# EAGLE design nyuulyzerv1 (EAGLE 5.11)
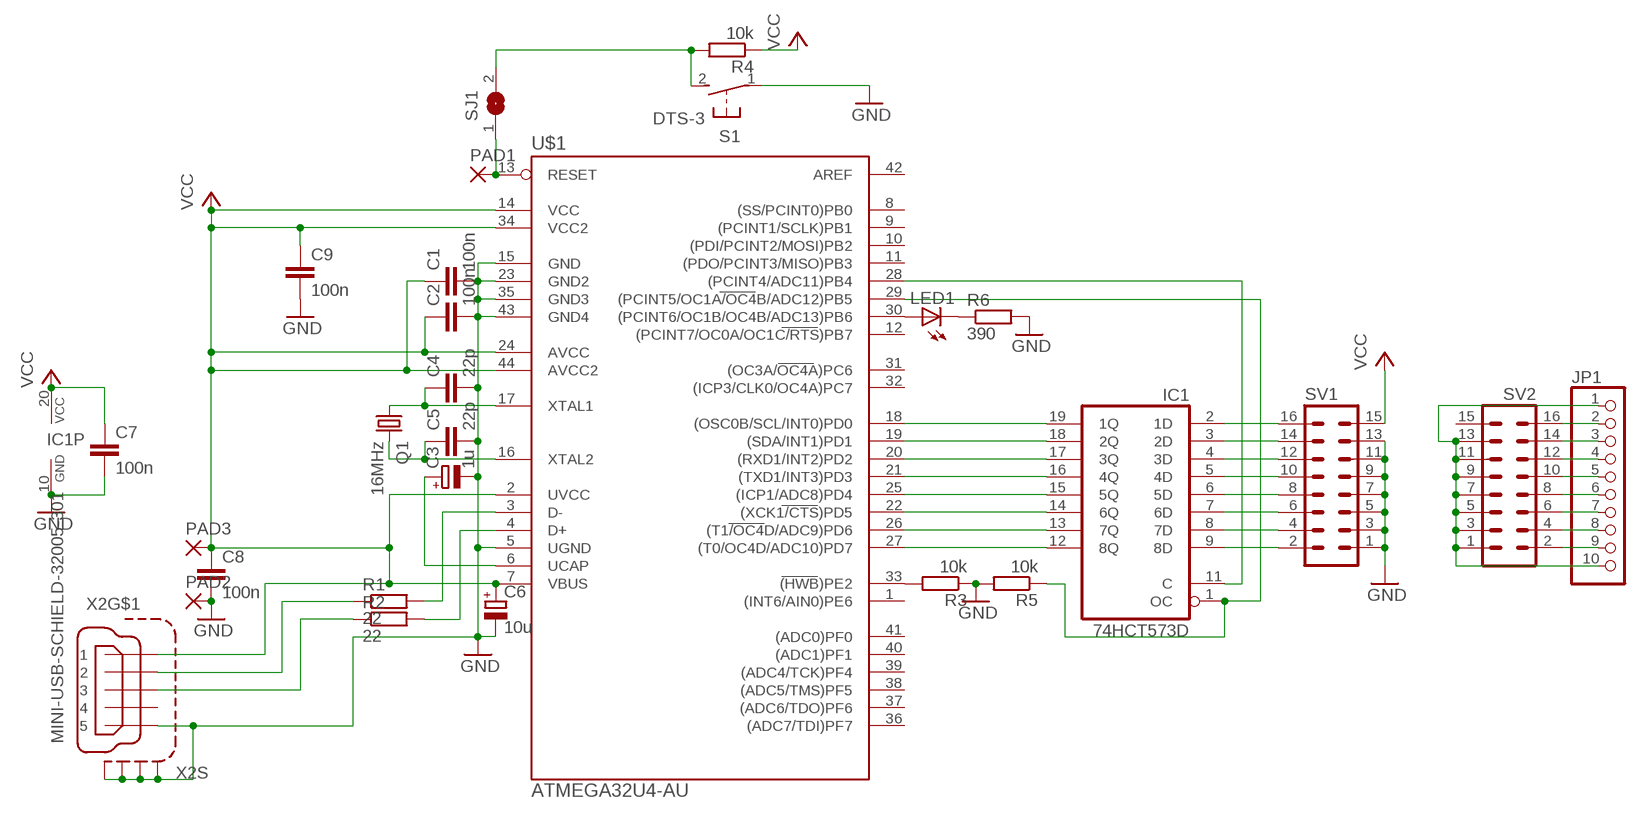
[diagram p0: schematic, sheet 1]

## Parts
C1  100n  C-EUC0805  [C0805]
C2  100n  C-EUC0805  [C0805]
C3  1u  CPOL-EUUD-4X5,8  [UD-4X5,8_NICHICON]
C4  22p  C-EUC0805  [C0805]
C5  22p  C-EUC0805  [C0805]
C6  10u  CPOL-EUUD-4X5,8  [UD-4X5,8_NICHICON]
C7  100n  C-EUC0805  [C0805]
C8  100n  C-EUC0805  [C0805]
C9  100n  C-EUC0805  [C0805]
IC1  74HCT573D  [SO20W]
JP1  PINHD-1X10/90  [1X10/90]
LED1  LEDCHIPLED_1206  [CHIPLED_1206]
PAD1  SMD2  [SMD1,27-2,54]
PAD2  SMD2  [SMD1,27-2,54]
PAD3  SMD2  [SMD1,27-2,54]
Q1  16MHz  CRYSTALHC49S  [HC49/S]
R1  22  R-EU_M0805  [M0805]
R2  22  R-EU_M0805  [M0805]
R3  10k  R-EU_R0805  [R0805]
R4  10k  R-EU_R0805  [R0805]
R5  10k  R-EU_R0805  [R0805]
R6  390  R-EU_R0805  [R0805]
S1  DTS-3  [DTS-3]
SJ1  SJ  [SJ]
SV1  ML16  [ML16]
SV2  ML16  [ML16]
U$1  ATMEGA32U4-AU  [TQFP44]
X2  MINI-USB-SCHIELD-32005-301  [32005-301]

## Nets
GND: C1.2 C2.2 C3.- C4.2 C5.2 C6.- C7.2 C8.2 C9.2 IC1.10(GND) PAD2.1(P) R3.1 R5.2 R6.2 S1.1 SV1.1 SV1.3 SV1.5 SV1.7 SV1.9 SV1.11 SV1.13 U$1.5(UGND) U$1.15(GND) U$1.23(GND2) U$1.35(GND3) U$1.43(GND4) X2.5 X2.M1(S:S1) X2.M2(S:S2) X2.M3(S:S3) X2.M4(S:S4)
N$1: R1.1 X2.2
N$2: R2.1 X2.3
N$3: R3.2 U$1.33((HWB)PE2)
N$4: R1.2 U$1.3(D-)
N$5: R2.2 U$1.4(D+)
N$6: PAD1.1(P) SJ1.1 U$1.13(RESET)
N$7: IC1.12(8Q) U$1.27((T0/OC4D/ADC10)PD7)
N$8: IC1.13(7Q) U$1.26((T1/OC4D/ADC9)PD6)
N$9: IC1.14(6Q) U$1.22((XCK1/CTS)PD5)
N$10: IC1.15(5Q) U$1.25((ICP1/ADC8)PD4)
N$11: IC1.16(4Q) U$1.21((TXD1/INT3)PD3)
N$12: IC1.17(3Q) U$1.20((RXD1/INT2)PD2)
N$13: IC1.18(2Q) U$1.19((SDA/INT1)PD1)
N$14: C3.+ U$1.6(UCAP)
N$15: IC1.19(1Q) U$1.18((OSC0B/SCL/INT0)PD0)
N$16: IC1.9(8D) SV1.2
N$17: IC1.1(OC) R5.1 U$1.29((PCINT5/OC1A/OC4B/ADC12)PB5)
N$18: IC1.8(7D) SV1.4
N$19: IC1.7(6D) SV1.6
N$20: IC1.6(5D) SV1.8
N$21: IC1.5(4D) SV1.10
N$22: IC1.4(3D) SV1.12
N$23: IC1.3(2D) SV1.14
N$24: IC1.2(1D) SV1.16
N$25: C4.1 Q1.1 U$1.17(XTAL1)
N$26: C5.1 Q1.2 U$1.16(XTAL2)
N$27: IC1.11(C) U$1.28((PCINT4/ADC11)PB4)
N$28: LED1.A U$1.30((PCINT6/OC1B/OC4B/ADC13)PB6)
N$29: LED1.C R6.1
N$30: JP1.1 JP1.10 SV2.1 SV2.3 SV2.5 SV2.7 SV2.9 SV2.11 SV2.13
N$31: JP1.2 SV2.16
N$32: JP1.3 SV2.14
N$33: JP1.4 SV2.12
N$34: JP1.5 SV2.10
N$35: JP1.6 SV2.8
N$36: JP1.7 SV2.6
N$37: JP1.8 SV2.4
N$38: JP1.9 SV2.2
RST: R4.2 S1.2 SJ1.2
VCC: C1.1 C2.1 C6.+ C7.1 C8.1 C9.1 IC1.20(VCC) PAD3.1(P) R4.1 SV1.15 U$1.2(UVCC) U$1.7(VBUS) U$1.14(VCC) U$1.24(AVCC) U$1.34(VCC2) U$1.44(AVCC2) X2.1
Unconnected: SV2.15 U$1.1((INT6/AIN0)PE6) U$1.8((SS/PCINT0)PB0) U$1.9((PCINT1/SCLK)PB1) U$1.10((PDI/PCINT2/MOSI)PB2) U$1.11((PDO/PCINT3/MISO)PB3) U$1.12((PCINT7/OC0A/OC1C/RTS)PB7) U$1.31((OC3A/OC4A)PC6) U$1.32((ICP3/CLK0/OC4A)PC7) U$1.36((ADC7/TDI)PF7) U$1.37((ADC6/TDO)PF6) U$1.38((ADC5/TMS)PF5) U$1.39((ADC4/TCK)PF4) U$1.40((ADC1)PF1) U$1.41((ADC0)PF0) U$1.42(AREF) X2.4

## Library data of the parts
C1 C2 C4 C5 C7-C9 = rcl:C-EU: CAPACITOR, European symbol
C3 C6 = rcl:CPOL-EU: POLARIZED CAPACITOR, European symbol
IC1 = 74xx-eu:74*573: 8-bit D latch BUS DRIVER
JP1 = pinhead:PINHD-1X10: PIN HEADER
LED1 = led:LED: LED OSRAM: - CHIPLED LG R971, LG N971, LY N971, LG Q971, LY Q971, LO R971, LY R971 LH N974, LH R974 LS Q976, LO Q976, LY Q976 LO Q996 - Hyper CHIPLED LW Q18S LB Q993, LB Q99A, LB R99A - SideLED LS A670, LO A670, LY A670, LG A670, LP A670 LB A673, LV A673, LT A673, LW A673 LH A674 LY A675 LS A676, LA A676, LO A676, LY A676, LW A676 LS A679, LY A679, LG A679 - Hyper Micro SIDELED® LS Y876, LA Y876, LO Y876, LY Y876 LT Y87S - SmartLED LW L88C, LW L88S LB L89C, LB L89S, LG L890 LS L89K, LO L89K, LY L89K LS L896, LA L896, LO L896, LY L896 - TOPLED LS T670, LO T670, LY T670, LG T670, LP T670 LSG T670, LSP T670, LSY T670, LOP T670, LYG T670 LG T671, LOG T671, LSG T671 LB T673, LV T673, LT T673, LW T673 LH T674 LS T676, LA T676, LO T676, LY T676, LB T676, LH T676, LSB T676, LW T676 LB T67C, LV T67C, LT T67C, LS T67K, LO T67K, LY T67K, LW E67C LS E67B, LA E67B, LO E67B, LY E67B, LB E67C, LV E67C, LT E67C LW T67C LS T679, LY T679, LG T679 LS T770, LO T770, LY T770, LG T770, LP T770 LB T773, LV T773, LT T773, LW T773 LH T774 LS E675, LA E675, LY E675, LS T675 LS T776, LA T776, LO T776, LY T776, LB T776 LHGB T686 LT T68C, LB T68C - Hyper Mini TOPLED® LB M676 - Mini TOPLED Santana® LG M470 LS M47K, LO M47K, LY M47K Source: http://www.osram.convergy.de LUXEON: - LUMILED® LXK2-PW12-R00, LXK2-PW12-S00, LXK2-PW14-U00, LXK2-PW14-V00 LXK2-PM12-R00, LXK2-PM12-S00, LXK2-PM14-U00 LXK2-PE12-Q00, LXK2-PE12-R00, LXK2-PE12-S00, LXK2-PE14-T00, LXK2-PE14-U00 LXK2-PB12-K00, LXK2-PB12-L00, LXK2-PB12-M00, LXK2-PB14-N00, LXK2-PB14-P00, LXK2-PB14-Q00 LXK2-PR12-L00, LXK2-PR12-M00, LXK2-PR14-Q00, LXK2-PR14-R00 LXK2-PD12-Q00, LXK2-PD12-R00, LXK2-PD12-S00 LXK2-PH12-R00, LXK2-PH12-S00 LXK2-PL12-P00, LXK2-PL12-Q00, LXK2-PL12-R00 Source: www.luxeon.com KINGBRIGHT: KA-3528ASYC Source: www.kingbright.com
PAD1-PAD3 = wirepad:SMD2: SMD PAD
Q1 = crystal:CRYSTAL: CRYSTAL
R1-R6 = rcl:R-EU_: RESISTOR, European symbol
S1 = switch-tact:DTS-3
SJ1 = jumper:SJ: SMD solder JUMPER
SV1 SV2 = con-harting-ml:ML16: HARTING; OC_FARNELL: unknown; OC_NEWARK: unknown
U$1 = mega32U4:ATMEGA32U4-AU
X2 = con-cypressindustries:MINI-USB-SCHIELD-: MINI USB-B Conector Source: www.cypressindustries.com; OC_FARNELL: unknown; OC_NEWARK: unknown

## Board
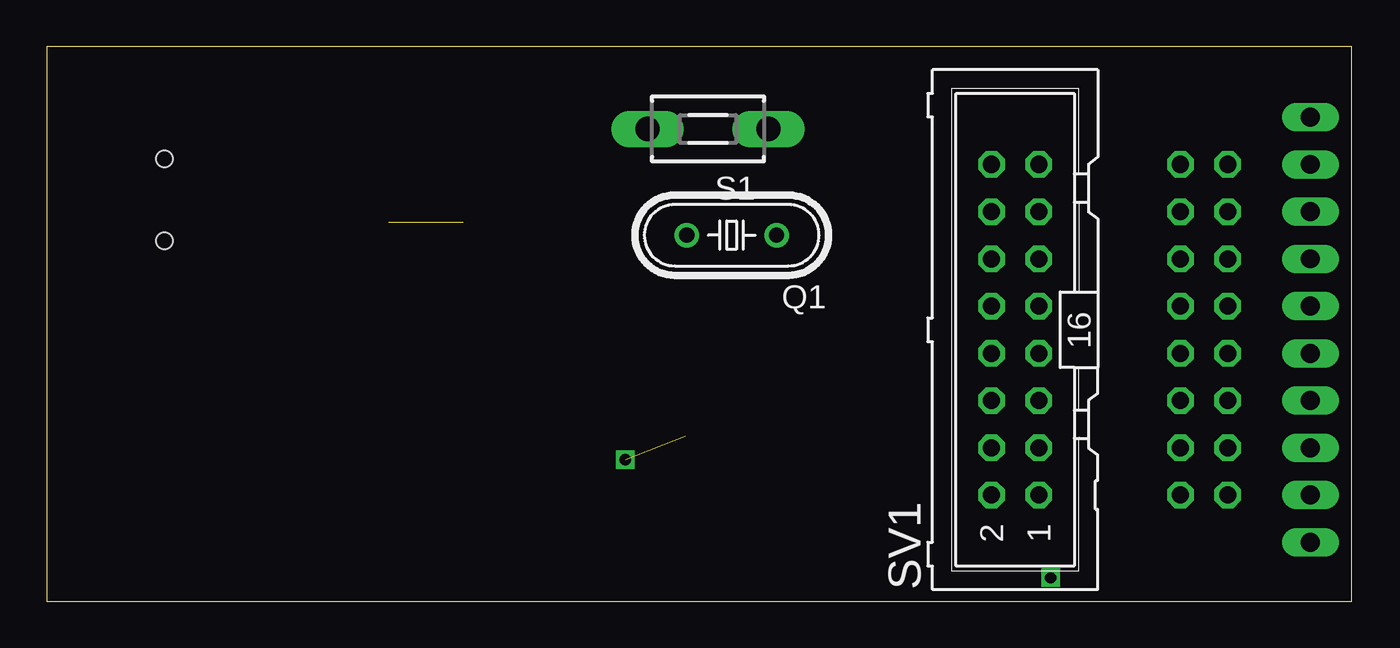
[diagram p1: board, top side]
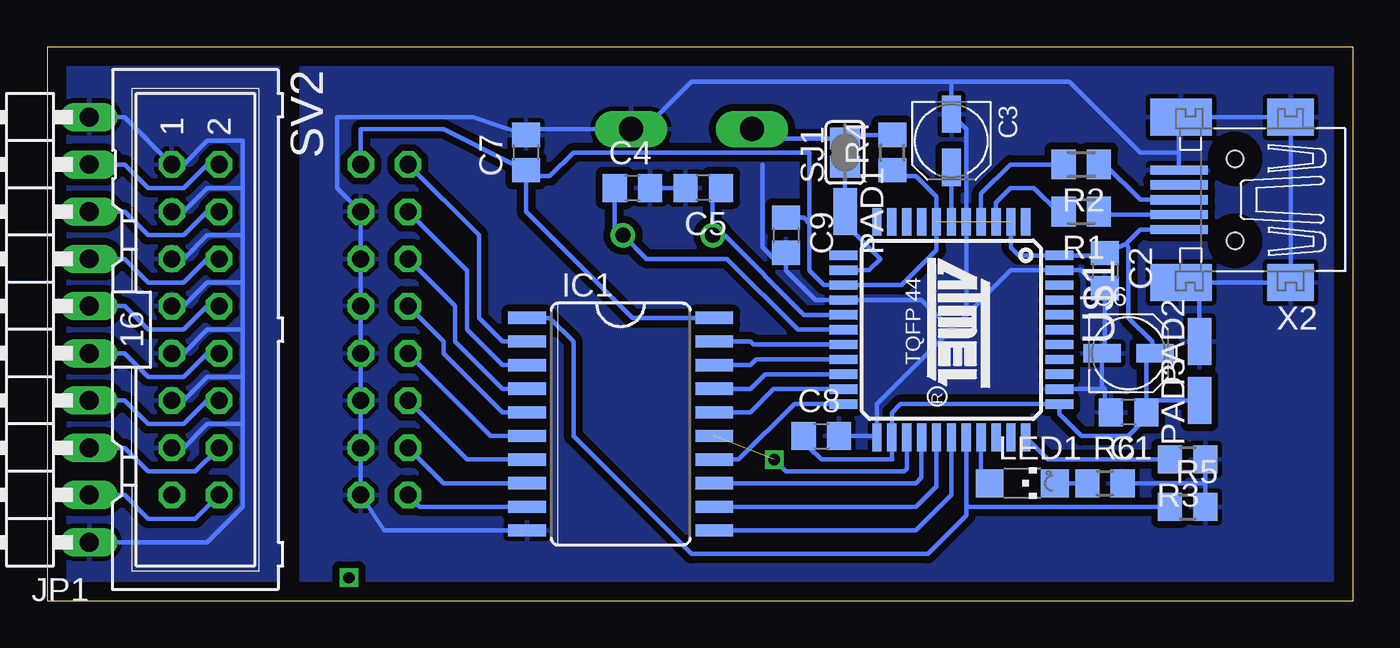
[diagram p2: board, bottom side, seen from below]

Size 70.16 x 29.84 mm. Coordinates in mm from the lower left corner, seen from the top.
Outline: 0,0 70.16,0 70.16,29.84 0,29.84 0,0
Copper layers (1*16): Top 0.035mm / dielectric 1.5mm / Bottom 0.035mm
Design rules "default": minimum track width 10mil, minimum drill 24mil, track to track 8mil, track to pad 8mil, pad to pad 8mil, via to via 8mil, smd to smd 8mil, copper to edge 40mil, drill to drill 8mil, minimum pad ring 10mil, minimum via ring 8mil, stop-mask expansion 4mil, vias tented up to drill 0mil, thermal gap 10mil

### Footprints (pad centres in the part's own frame; a part is rotated, then mirrored left to right if it is on the bottom)
C0805 = smd 1.3 x 1.5: 1 -0.95,0; 2 0.95,0
UD-4X5,8_NICHICON = smd 2 x 1: + 1.425,0; - -1.425,0
SO20W = smd 0.66 x 2.032: 1 -5.715,-5.029; 2 -4.445,-5.029; 3 -3.175,-5.029; 4 -1.905,-5.029; 5 -0.635,-5.029; 6 0.635,-5.029; 7 1.905,-5.029; 8 3.175,-5.029; 9 4.445,-5.029; 10 5.715,-5.029; 11 5.715,5.029; 12 4.445,5.029; 13 3.175,5.029; 14 1.905,5.029; 15 0.635,5.029; 16 -0.635,5.029; 17 -1.905,5.029; 18 -3.175,5.029; 19 -4.445,5.029; 20 -5.715,5.029
1X10/90 = drill 1.016 long: 1 -11.43,-3.81; 2 -8.89,-3.81; 3 -6.35,-3.81; 4 -3.81,-3.81; 5 -1.27,-3.81; 6 1.27,-3.81; 7 3.81,-3.81; 8 6.35,-3.81; 9 8.89,-3.81; 10 11.43,-3.81
CHIPLED_1206 = smd 1.5 x 1.5: A 0,-1.75; C 0,1.75
SMD1,27-2,54 = smd 1.27 x 2.54: 1 0,0
HC49/S = drill 0.813 round: 1 -2.413,0; 2 2.413,0
M0805 = smd 1.3 x 1.6: 1 -0.95,0; 2 0.95,0
R0805 = smd 1.3 x 1.5: 1 -0.95,0; 2 0.95,0
DTS-3 = drill 1.3 long: 1 -3.25,0; 2 3.25,0
SJ = smd 1.168 x 1.6: 1 -0.762,0; 2 0.762,0
ML16 = drill 0.914 octagon: 1 -8.89,-1.27; 2 -8.89,1.27; 3 -6.35,-1.27; 4 -6.35,1.27; 5 -3.81,-1.27; 6 -3.81,1.27; 7 -1.27,-1.27; 8 -1.27,1.27; 9 1.27,-1.27; 10 1.27,1.27; 11 3.81,-1.27; 12 3.81,1.27; 13 6.35,-1.27; 14 6.35,1.27; 15 8.89,-1.27; 16 8.89,1.27
TQFP44 = smd 1.5 x 0.5: 1 -5.8,4; 2 -5.8,3.2; 3 -5.8,2.4; 4 -5.8,1.6; 5 -5.8,0.8; 6 -5.8,0; 7 -5.8,-0.8; 8 -5.8,-1.6; 9 -5.8,-2.4; 10 -5.8,-3.2; 11 -5.8,-4; 23 5.8,-4; 24 5.8,-3.2; 25 5.8,-2.4; 26 5.8,-1.6; 27 5.8,-0.8; 28 5.8,0; 29 5.8,0.8; 30 5.8,1.6; 31 5.8,2.4; 32 5.8,3.2; 33 5.8,4 | smd 0.5 x 1.5: 12 -4,-5.8; 13 -3.2,-5.8; 14 -2.4,-5.8; 15 -1.6,-5.8; 16 -0.8,-5.8; 17 0,-5.8; 18 0.8,-5.8; 19 1.6,-5.8; 20 2.4,-5.8; 21 3.2,-5.8; 22 4,-5.8; 34 4,5.8; 35 3.2,5.8; 36 2.4,5.8; 37 1.6,5.8; 38 0.8,5.8; 39 0,5.8; 40 -0.8,5.8; 41 -1.6,5.8; 42 -2.4,5.8; 43 -3.2,5.8; 44 -4,5.8
32005-301 = smd 3.1 x 0.5: 1 3,1.6; 2 3,0.8; 3 3,0; 4 3,-0.8; 5 3,-1.6 | smd 2.5 x 2: M1 -3,-4.45; M2 -3,4.45 | smd 3.3 x 2: M3 2.9,4.45; M4 2.9,-4.45 | hole 0.9: 0,2.2; 0,-2.2

### Placement (x,y rotation side)
C1  12.06,10.16 180 bottom
C2  13.34,17.78 270 bottom
C3  21.59,24.77 270 bottom
C4  38.73,22.23 0 bottom
C5  34.92,22.23 180 bottom
C6  12.06,13.34 0 bottom
C7  44.45,24.13 90 bottom
C8  28.57,8.89 0 bottom
C9  30.48,19.68 270 bottom
IC1  39.37,9.53 270 bottom
JP1  71.75,14.61 90 bottom
LED1  17.78,6.35 270 bottom
PAD1  27.3,20.95 180 bottom
PAD2  8.26,13.97 0 bottom
PAD3  8.26,10.79 0 bottom
Q1  36.83,19.68 180 top
R1  14.61,20.95 180 bottom
R2  14.61,23.5 180 bottom
R3  8.89,7.62 180 bottom
R4  24.77,24.13 90 bottom
R5  8.89,5.08 0 bottom
R6  13.34,6.35 0 bottom
S1  35.56,25.4 180 top
SJ1  27.3,24.13 90 bottom
SV1  52.07,14.61 90 top
SV2  62.23,14.61 270 bottom
U$1  21.59,14.61 270 bottom
X2  6.35,21.59 180 bottom

### Tracks (layer width: path | path; a pad name or v marks a point on that pad's centre or on a via)
GND
  Bottom 0.254: 20.79,15.4 18.39,17.8 U$1.43 14.63,17.8 13.97,17.14 13.02,17.14 C2.2 13.34,13.49 C6.- 13.49,11.59 13.34,11.43 | 20.79,15.4 U$1.5 20.79,25.39 C3.- 21.59,27.94 | 20.79,15.4 21.59,14.61 | 21.59,14.61 25.59,10.61 U$1.23 25.68,8.89 C8.2 | U$1.35 13.36,11.4 13.34,11.43 | 13.34,11.43 13.34,10.48 C1.2 | C5.2 C4.2 | 21.59,14.61 23.19,16.2 U$1.15 28.91,16.2 30.48,17.78 C9.2 | R5.2 7.94,6.35 | 7.94,6.35 R3.1 | IC1.10 52.07,3.81 SV1.1 SV1.3 SV1.5 SV1.7 SV1.9 SV1.11 SV1.13 54.61,22.23 54.61,26.04 47.31,26.04 C7.2 44.13,25.4 S1.1 38.1,25.4 35.56,27.94 21.59,27.94 | PAD2.1 8.26,16.51 9.53,17.78 9.53,17.41 X2.M3 X2.M2 X2.M1 X2.M4 9.35,25.94 9.35,24.13 | 9.35,24.13 X2.5 | 21.59,27.94 15.24,27.94 11.43,24.13 9.35,24.13 | 7.94,6.35 R6.2 | 30.48,18.41 31.11,18.41 31.75,19.05 31.75,23.5
  pour Bottom (isolate 0.381): 0,29.84 56.52,29.84 56.52,0 0,0
N$1
  Bottom 0.254: X2.2 13.49,20.79 R1.1
N$2
  Bottom 0.254: X2.3 11.43,21.59 13.34,23.5 R2.1
N$3
  Bottom 0.254: R3.2 16.41,7.62 U$1.33
N$4
  Bottom 0.254: U$1.3 19.19,21.45 18.41,22.23 17.14,22.23 15.88,20.95 R1.2
N$5
  Bottom 0.254: U$1.4 19.99,21.92 18.41,23.5 R2.2
N$6
  Bottom 0.254: U$1.13 26.01,17.8 25.4,18.41 27.3,20.32 PAD1.1 SJ1.1
N$7
  Bottom 0.254: U$1.27 22.39,6.18 23.5,5.08 IC1.12
N$8
  Bottom 0.254: U$1.26 23.19,6.66 23.5,6.35 IC1.13
N$9
  Bottom 0.254: U$1.22 30.04,10.61 33.02,7.62 IC1.14
N$10  (via drill 0.6)  (1 unrouted)
  Bottom 0.254: U$1.25 23.99,7.12 24.13,6.99 30.48,6.99 v31.11,7.62
N$11
  Bottom 0.254: U$1.21 31.14,11.4 32.38,10.16 IC1.16
N$12
  Bottom 0.254: U$1.20 31.61,12.21 32.38,11.43 IC1.17
N$13
  Bottom 0.254: U$1.19 32.08,13.01 32.38,12.7 IC1.18
N$14
  Bottom 0.254: U$1.6 C3.+
N$15
  Bottom 0.254: U$1.18 32.22,13.8 32.38,13.97 IC1.19
N$16
  Bottom 0.254: IC1.9 50.16,5.08 SV1.2
N$17
  Bottom 0.254: IC1.1 43.18,15.24 41.91,13.97 41.91,8.89 35.56,2.54 22.86,2.54 20.79,4.61 20.79,5.08 | 20.79,5.08 U$1.29 | R5.1 20.79,5.08
N$18
  Bottom 0.254: IC1.8 48.9,6.35 SV1.4
N$19
  Bottom 0.254: IC1.7 47.62,7.62 SV1.6
N$20
  Bottom 0.254: IC1.6 46.35,8.89 SV1.8
N$21
  Bottom 0.254: IC1.5 45.72,10.16 48.9,13.34 48.9,13.97 SV1.10
N$22
  Bottom 0.254: IC1.4 45.72,11.43 48.26,13.97 48.26,15.88 SV1.12
N$23
  Bottom 0.254: IC1.3 45.72,12.7 47.62,14.61 47.62,17.78 SV1.14
N$24
  Bottom 0.254: IC1.2 45.72,13.97 46.99,15.24 46.99,19.68 SV1.16
N$25
  Bottom 0.254: U$1.17 29.84,14.61 33.66,18.41 37.97,18.41 Q1.1 39.69,20.13 C4.1
N$26
  Bottom 0.254: C5.1 34.42,21.78 Q1.2 33.78,19.68 29.5,15.4 U$1.16
N$27
  Bottom 0.254: U$1.28 21.59,5.71 23.5,3.81 IC1.11
N$28
  Bottom 0.254: U$1.30 19.99,6.81 LED1.A
N$29
  Bottom 0.254: R6.1 LED1.C
N$30
  Bottom 0.254: SV2.13 62.87,8.26 61.59,9.53 59.69,9.53 | 59.69,9.53 59.69,5.08 61.59,3.17 JP1.1 | JP1.10 66.04,26.04 SV2.1 62.87,23.5 61.59,24.77 59.69,24.77 59.69,22.23 | 59.69,19.68 59.69,22.23 | 59.69,17.14 59.69,19.68 | 59.69,14.61 59.69,17.14 | 59.69,12.06 59.69,14.61 | 59.69,9.53 59.69,12.06 | SV2.11 62.87,10.79 61.59,12.06 59.69,12.06 | SV2.9 62.87,13.34 61.59,14.61 59.69,14.61 | SV2.7 62.87,15.88 61.59,17.14 59.69,17.14 | SV2.5 62.87,18.41 61.59,19.68 59.69,19.68 | SV2.3 62.87,20.95 61.59,22.23 59.69,22.23
  pour Bottom (isolate 0.381): 57.78,29.84 69.85,29.84 69.85,0 57.78,0
N$31
  Bottom 0.254: JP1.2 66.04,5.71 64.77,4.45 62.23,4.45 SV2.16
N$32
  Bottom 0.254: JP1.3 66.04,8.26 64.77,6.99 62.23,6.99 SV2.14
N$33
  Bottom 0.254: JP1.4 66.04,10.79 64.77,9.53 62.87,9.53 61.59,10.79 SV2.12
N$34
  Bottom 0.254: JP1.5 66.04,13.34 64.77,12.06 62.87,12.06 61.59,13.34 SV2.10
N$35
  Bottom 0.254: JP1.6 66.04,15.88 64.77,14.61 62.87,14.61 61.59,15.88 SV2.8
N$36
  Bottom 0.254: JP1.7 66.04,18.41 64.77,17.14 62.87,17.14 61.59,18.41 SV2.6
N$37
  Bottom 0.254: JP1.8 66.04,20.95 64.77,19.68 62.87,19.68 61.59,20.95 SV2.4
N$38
  Bottom 0.254: JP1.9 66.04,23.5 64.77,22.23 62.87,22.23 61.59,23.5 SV2.2
N$39  (via drill 0.6)
  other vias: 53.98,1.27
RST
  Bottom 0.254: R4.2 27.12,25.08 SJ1.2 31.8,24.89 S1.2
VCC  (1 unrouted)
  Bottom 0.254: X2.1 11.44,19.99 12.22,19.21 | 12.22,19.21 C2.1 12.82,18.61 U$1.44 17.97,18.61 18.39,19.02 U$1.2 | 12.22,19.21 12.06,19.05 12.06,15.24 10.79,13.97 10.79,13.49 C6.+ 11.12,12.86 C1.1 11.43,9.85 | C8.1 29.21,8.57 29.21,8.26 28.57,7.62 24.77,7.62 24.79,7.64 U$1.24 24.79,10.13 24.32,10.61 U$1.34 15.79,10.07 14.61,8.89 12.06,8.89 11.43,9.53 11.43,9.85 | IC1.20 38.73,15.24 44.45,20.95 C7.1 | SV1.15 53.34,25.4 48.9,25.4 45.09,23.5 44.77,23.5 C7.1 | 29.21,20.32 29.21,17.78 28.43,17 U$1.14 24.27,17 22.39,18.89 U$1.7 22.39,21.75 23.5,22.86 24.45,22.86 R4.1 | 29.21,20.32 29.21,24.13 41.91,24.13 43.18,22.86 44.13,22.86 C7.1 | PAD3.1 11.43,10.79 11.43,9.85 | C9.1 29.52,20.64 29.21,20.32